# Altium schematic sheet INPUT.SchDoc
size A4
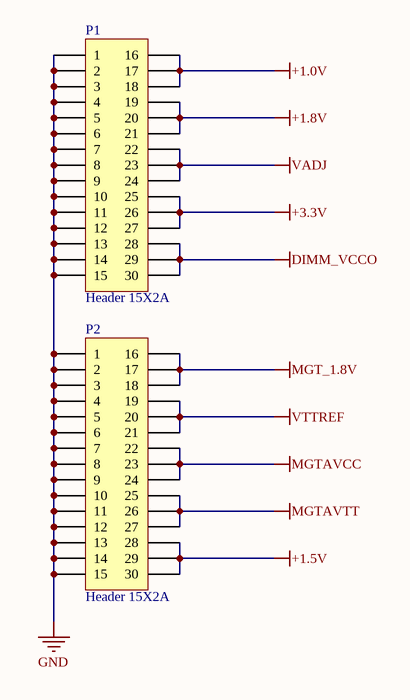
[diagram p0: INPUT.SchDoc]

## Parts
P1  Header 15X2A  [HDR2X15_CEN]
P2  Header 15X2A  [HDR2X15_CEN]

## Nets
+1.0V: P1.16 P1.17 P1.18
+1.5V: P2.28 P2.29 P2.30
+1.8V: P1.19 P1.20 P1.21
+3.3V: P1.25 P1.26 P1.27
DIMM_VCCO: P1.28 P1.29 P1.30
GND: P1.1 P1.2 P1.3 P1.4 P1.5 P1.6 P1.7 P1.8 P1.9 P1.10 P1.11 P1.12 P1.13 P1.14 P1.15 P2.1 P2.2 P2.3 P2.4 P2.5 P2.6 P2.7 P2.8 P2.9 P2.10 P2.11 P2.12 P2.13 P2.14 P2.15
MGT_1.8V: P2.16 P2.17 P2.18
MGTAVCC: P2.22 P2.23 P2.24
MGTAVTT: P2.25 P2.26 P2.27
VADJ: P1.22 P1.23 P1.24
VTTREF: P2.19 P2.20 P2.21

## Library data of the parts
P1 P2 = Header 15X2A: Header, 15-Pin, Dual row; LatestRevisionDate: 17-Jul-2002; LatestRevisionNote: Re-released for DXP Platform.; Publisher: Altium Limited